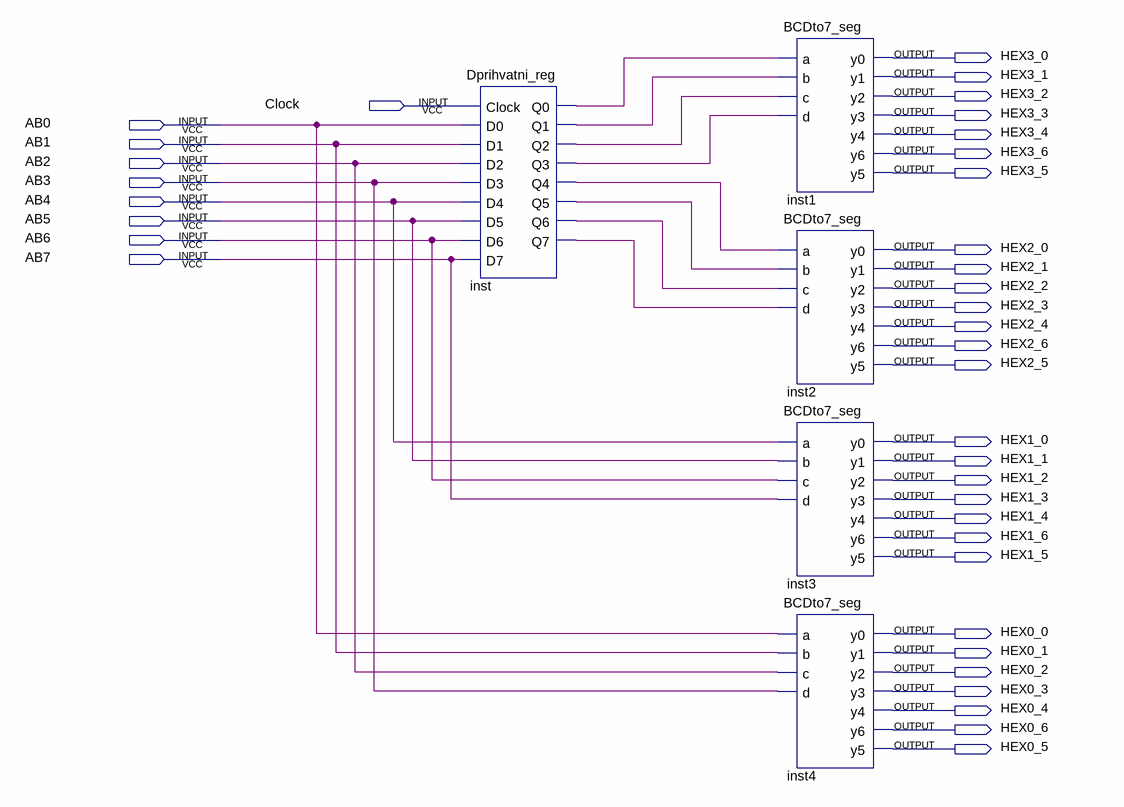
[diagram p0: schematic sheet]
// Quartus schematic DisplayA_B.bdf as structural Verilog: 5 symbols, 37 pins
module DisplayA_B (
  input  Clock,
  input  AB0,
  input  AB1,
  input  AB2,
  input  AB3,
  input  AB4,
  input  AB5,
  input  AB6,
  input  AB7,
  output HEX3_0,
  output HEX3_1,
  output HEX3_2,
  output HEX3_3,
  output HEX3_4,
  output HEX3_6,
  output HEX3_5,
  output HEX2_0,
  output HEX2_1,
  output HEX2_2,
  output HEX2_3,
  output HEX2_4,
  output HEX2_6,
  output HEX2_5,
  output HEX1_0,
  output HEX1_1,
  output HEX1_2,
  output HEX1_3,
  output HEX1_4,
  output HEX1_6,
  output HEX1_5,
  output HEX0_0,
  output HEX0_1,
  output HEX0_2,
  output HEX0_3,
  output HEX0_4,
  output HEX0_6,
  output HEX0_5
);

  wire inst_q0, inst_q1, inst_q2, inst_q3, inst_q4, inst_q5, inst_q6, inst_q7;

  Dprihvatni_reg inst (
    .Clock(Clock), .D0(AB0), .D1(AB1), .D2(AB2), .D3(AB3), .D4(AB4), .D5(AB5), .D6(AB6), .D7(AB7),
    .Q0(inst_q0), .Q1(inst_q1), .Q2(inst_q2), .Q3(inst_q3), .Q4(inst_q4), .Q5(inst_q5), .Q6(inst_q6),
    .Q7(inst_q7));
  BCDto7_seg inst1 (
    .a(inst_q0), .b(inst_q1), .c(inst_q2), .d(inst_q3), .y0(HEX3_0), .y1(HEX3_1), .y2(HEX3_2), .y3(HEX3_3),
    .y4(HEX3_4), .y6(HEX3_6), .y5(HEX3_5));
  BCDto7_seg inst2 (
    .a(inst_q4), .b(inst_q5), .c(inst_q6), .d(inst_q7), .y0(HEX2_0), .y1(HEX2_1), .y2(HEX2_2), .y3(HEX2_3),
    .y4(HEX2_4), .y6(HEX2_6), .y5(HEX2_5));
  BCDto7_seg inst3 (
    .a(AB4), .b(AB5), .c(AB6), .d(AB7), .y0(HEX1_0), .y1(HEX1_1), .y2(HEX1_2), .y3(HEX1_3), .y4(HEX1_4),
    .y6(HEX1_6), .y5(HEX1_5));
  BCDto7_seg inst4 (
    .a(AB0), .b(AB1), .c(AB2), .d(AB3), .y0(HEX0_0), .y1(HEX0_1), .y2(HEX0_2), .y3(HEX0_3), .y4(HEX0_4),
    .y6(HEX0_6), .y5(HEX0_5));
endmodule
